# Altium schematic sheet HDMI8x8_OutputConnector.SchDoc
size Letter; Date: Not shown in title block; ApprovedBy: Not shown in title block; CheckedBy: Not shown in title block; Author: Not shown in title block; CompanyName: Not shown in title block; Engineer: Not shown in title block; Organization: Not shown in title block; Address1: Not shown in title block; Address2: Not shown in title block; Address3: Not shown in title block; Address4: Not shown in title block; DocumentNumber: 1; Revision: Use project parameter SCH_Rev; SheetNumber: 2; SheetTotal: 3; PageSetup: Record=PageOptions|CenterHorizontal=True|CenterVertical=True|PrintScale=1.00|XCorrection=1.00|YCorrection=1.00|PrintKind=0|BorderSize=5000000|LeftOffset=0|BottomOffset=0|Orientation=2|PaperLength=1000|PaperWidth=1000|Scale=100|PaperSource=15|PrintQuality=600|MediaType=1|DitherType=10|PaperKind=Letter|PrintScaleMode=1; CurrentTime: Not shown in title block; CurrentDate: Not shown in title block; Time: Not shown in title block; DocumentFullPathAndName: Not shown in title block; DocumentName: Not shown in title block; ModifiedDate: Not shown in title block; ImagePath: Not shown in title block
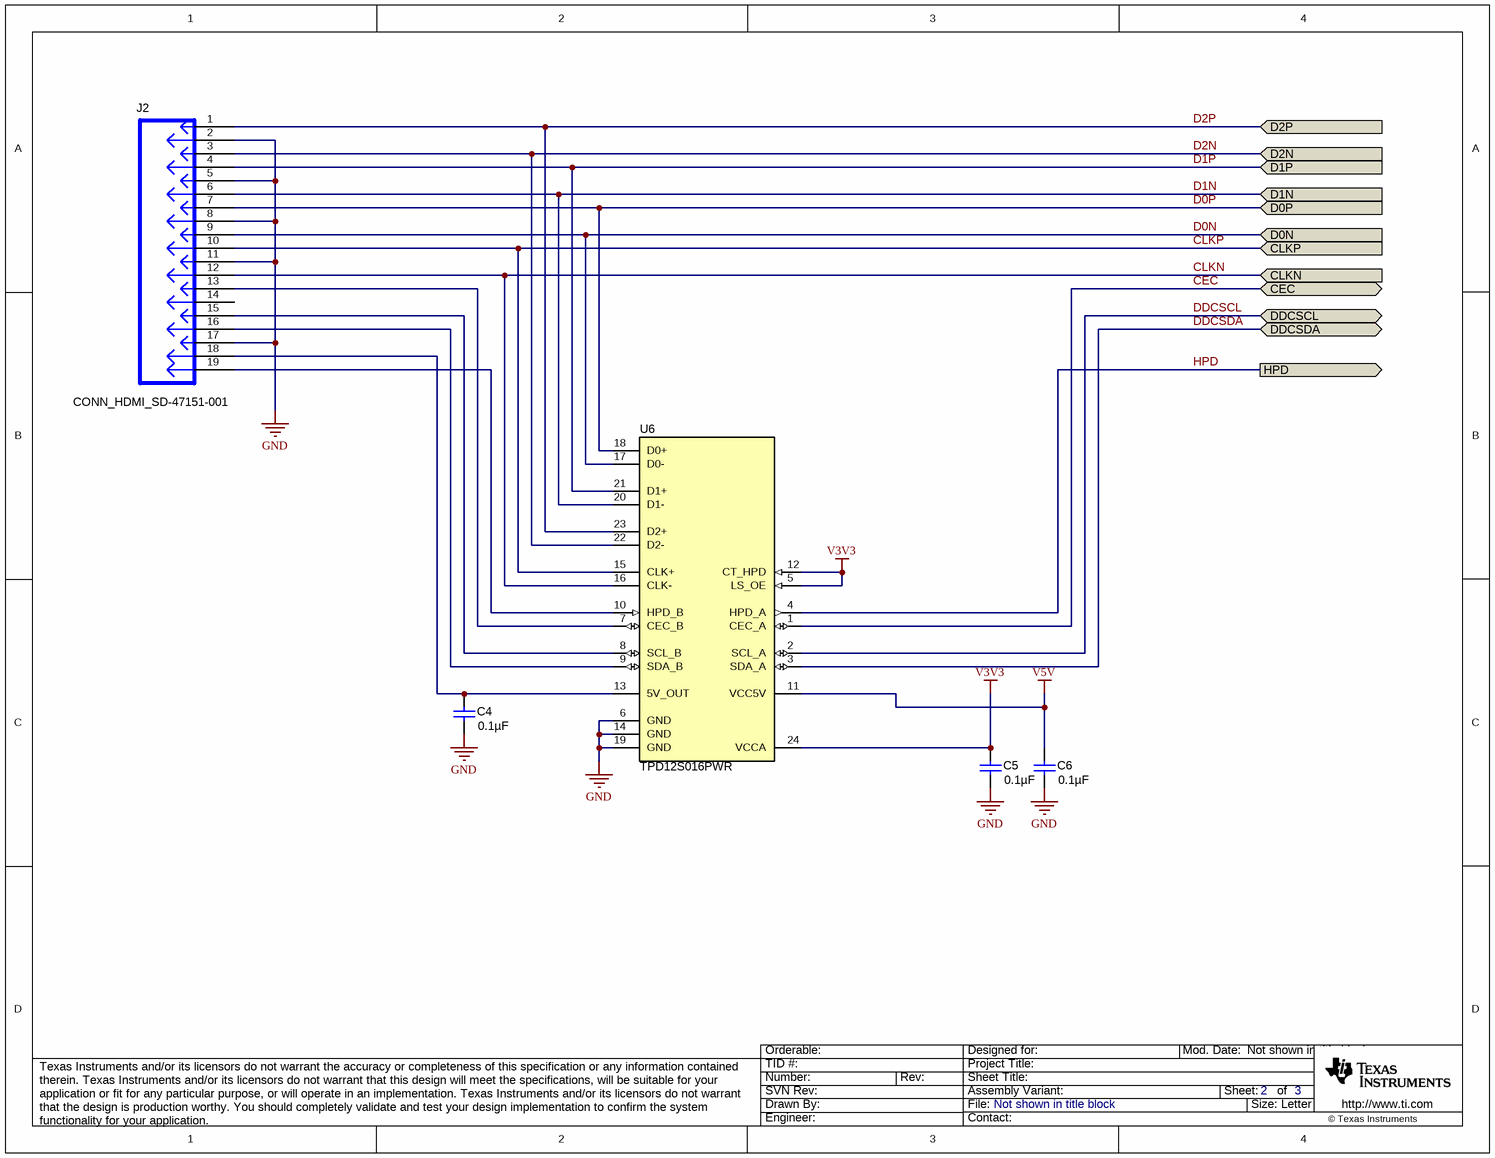
[diagram p0: HDMI8x8_OutputConnector.SchDoc]

## Parts
C4  ValueDisplayed: 0.1µF  [0603]  (hidden comment: C0603C104M4RACTU)
C5  ValueDisplayed: 0.1µF  [0603]  (hidden comment: C0603C104M4RACTU)
C6  ValueDisplayed: 0.1µF  [0603]  (hidden comment: C0603C104M4RACTU)
J2  CONN_HDMI_SD-47151-001  [CONN_HDMI_SD-47151]
U6  TPD12S016PWR  [PW0024A_N]

## Ports
CEC (bidir), CLKN (in), CLKP (in), D0N (in), D0P (in), D1N (in), D1P (in), D2N (in), D2P (in), DDCSCL (bidir), DDCSDA (bidir), HPD (out)

## Nets
GND: C4.2 C5.2 C6.2 J2.2 J2.5 J2.8 J2.11 J2.17 U6.6(GND) U6.14(GND) U6.19(GND)
V3V3: C5.1 U6.5(LS_OE) U6.12(CT_HPD) U6.24(VCCA)
V5V: C6.1 U6.11(VCC5V)
CEC: U6.1(CEC_A) ; port CEC
CLKN: J2.12 U6.16(CLK-) ; port CLKN
CLKP: J2.10 U6.15(CLK+) ; port CLKP
D0N: J2.9 U6.17(D0-) ; port D0N
D0P: J2.7 U6.18(D0+) ; port D0P
D1N: J2.6 U6.20(D1-) ; port D1N
D1P: J2.4 U6.21(D1+) ; port D1P
D2N: J2.3 U6.22(D2-) ; port D2N
D2P: J2.1 U6.23(D2+) ; port D2P
DDCSCL: U6.2(SCL_A) ; port DDCSCL
DDCSDA: U6.3(SDA_A) ; port DDCSDA
HPD: U6.4(HPD_A) ; port HPD
NetC4_1: C4.1 J2.18 U6.13(5V_OUT)
NetJ2_13: J2.13 U6.7(CEC_B)
NetJ2_15: J2.15 U6.8(SCL_B)
NetJ2_16: J2.16 U6.9(SDA_B)
NetJ2_19: J2.19 U6.10(HPD_B)

Not connected (* = marked no-connect by the designer): J2 14

## Notes on the sheet
- Drawn By:
- SVN Rev:
- Number:
- TID #:
- Orderable:
- Rev:
- Sheet Title:
- File:
- Project Title:
- Designed for:
- Assembly Variant:
- Mod. Date:
- Sheet:
- Size:
- of
- Letter
- http://www.ti.com
- Texas Instruments and/or its licensors do not warrant the accuracy or completeness of this specification or any information contained therein. Texas Instruments and/or its licensors do not warrant that this design will meet the specifications, will be suitable for your application or fit for any particular purpose, or will operate in an implementation. Texas Instruments and/or its licensors do not warrant that the design is production worthy. You should completely validate and test your design implementation to confirm the system functionality for your application.
- Engineer:
- Contact:
- © Texas Instruments

## Library data of the parts
C4-C6 = C0603C104M4RACTU: CAP, CERM, 0.1 µF, 16 V, +/- 20%, X7R, 0603; Manufacturer: Kemet; Polarized: N; CompType: Capacitor; Value: 0.1uF; U/M: EA; Cap_F: 0.0000001; Tolerance_%: 20; Value1: Unknown; VDC_V: 16; Value2: 16V; TaMin_C: -55; TaMax_C: 125; AEC Category: Q200; SymbolVersion: 2008-07-09; PartNumber: C0603C104M4RACTU; PackageReference: 0603; RoHS: Y; MountType: SMT; Technology: Ceramic; TempCo: X7R; Cap_Case: 0603; Published: 2008-06-19; Publisher: Texas Instruments; LatestRevisionDate: 2016-01-22; ComponentLink1Description: Datasheet link; ComponentLink1URL: http://www.kemet.com/kemet/web/homepage/kechome.nsf/vapubfiles/F3102_Y5V.pdf/$file/F3102_Y5V.pdf; Supplier 1: Digi-Key; Supplier Part Number 1: 399-1099-1-ND; Supplier 2: Mouser; Supplier Part Number 2: 80-C0603C104M4R; Supplier 3: Farnell; Supplier Part Number 3: 1166968; AEC Qualified: ?
J2 = CONN_HDMI_SD-47151-001: Connector, HDMI, RA, 19 pin; Manufacturer: Molex; PartNumber: SD-47151-0001; area: 255.00 mm; Value: SD-47151-0001; ComponentHeight: 4.5 mm; SymbolVersion: 10/16/2009 11:19:45; ComponentLink1URL: \\vette02\pmp_pcb\pcad_pdf's\471510001_sd.pdf; PackageReference: 12.50 x 15.00 mm; ComponentLink1Description: AEO Datasheet Link
U6 = TPD12S016PWR: Value-Line HDMI Companion Chip for Portable Applications, 12 Channels, -40 to +85 degC, 24-pin TSSOP (PW), Green (RoHS & no Sb/Br); Manufacturer: Texas Instruments; Alternate PartNumber: Equivalent; Breakdown Voltage(Min)(V): 9; Differential Capacitance(pF): 0.05; IEC 61000-4-2 Contact(+/- kV): 8; IO Capacitance(Typ)(pF): 1; IO Leakage Current(nA): 1000; SubFamily: ESD Solution; DatasheetVersion: SLLSE96A; PackageVersion: revG, Feb-2011; PackageReference: PW0024A; PackageDescription: 24-Pin Thin Small Outline Package 0.65 mm Pitch; Supplier 1: Digi-Key; Supplier Part Number 1: 296-29690-2-ND; Supplier 2: Digi-Key; Supplier Part Number 2: 296-29690-1-ND; Supplier 3: Digi-Key; Supplier Part Number 3: 296-29690-6-ND; Supplier 4: Farnell; Supplier Part Number 4: 2076029; Supplier 5: Newark; Supplier Part Number 5: 75T5157; Supplier 6: Newark; Supplier Part Number 6: 71T5431; Supplier 7: Mouser; Supplier Part Number 7: 595-TPD12S016PWR; Eco-Plan: Green (RoHS & no Sb/Br); MountType: SMT; Code_JEDEC: MO-153; PartNumber: TPD12S016PWR; ComponentLink1Description: Datasheet; ComponentLink1URL: http://www.ti.com/general/docs/lit/getliterature.tsp?genericPartNumber=TPD12S016&fileType=pdf; ComponentLink2Description: URL Link1; ComponentLink2URL: SamplesURL:http://www.ti.com/product/tpd12s016#samples; Alternate Manufacturer: Texas Instruments